# EAGLE design LED_STRING_MANAGER_REV 1 (EAGLE 9.6.2)
DOC_NAME: LED STRING MANAGER; DOC_NUMBER: N/A; DOC_REVISION: 1; INITIALS_DRAWN: KJD

## Sheet 1 of 2
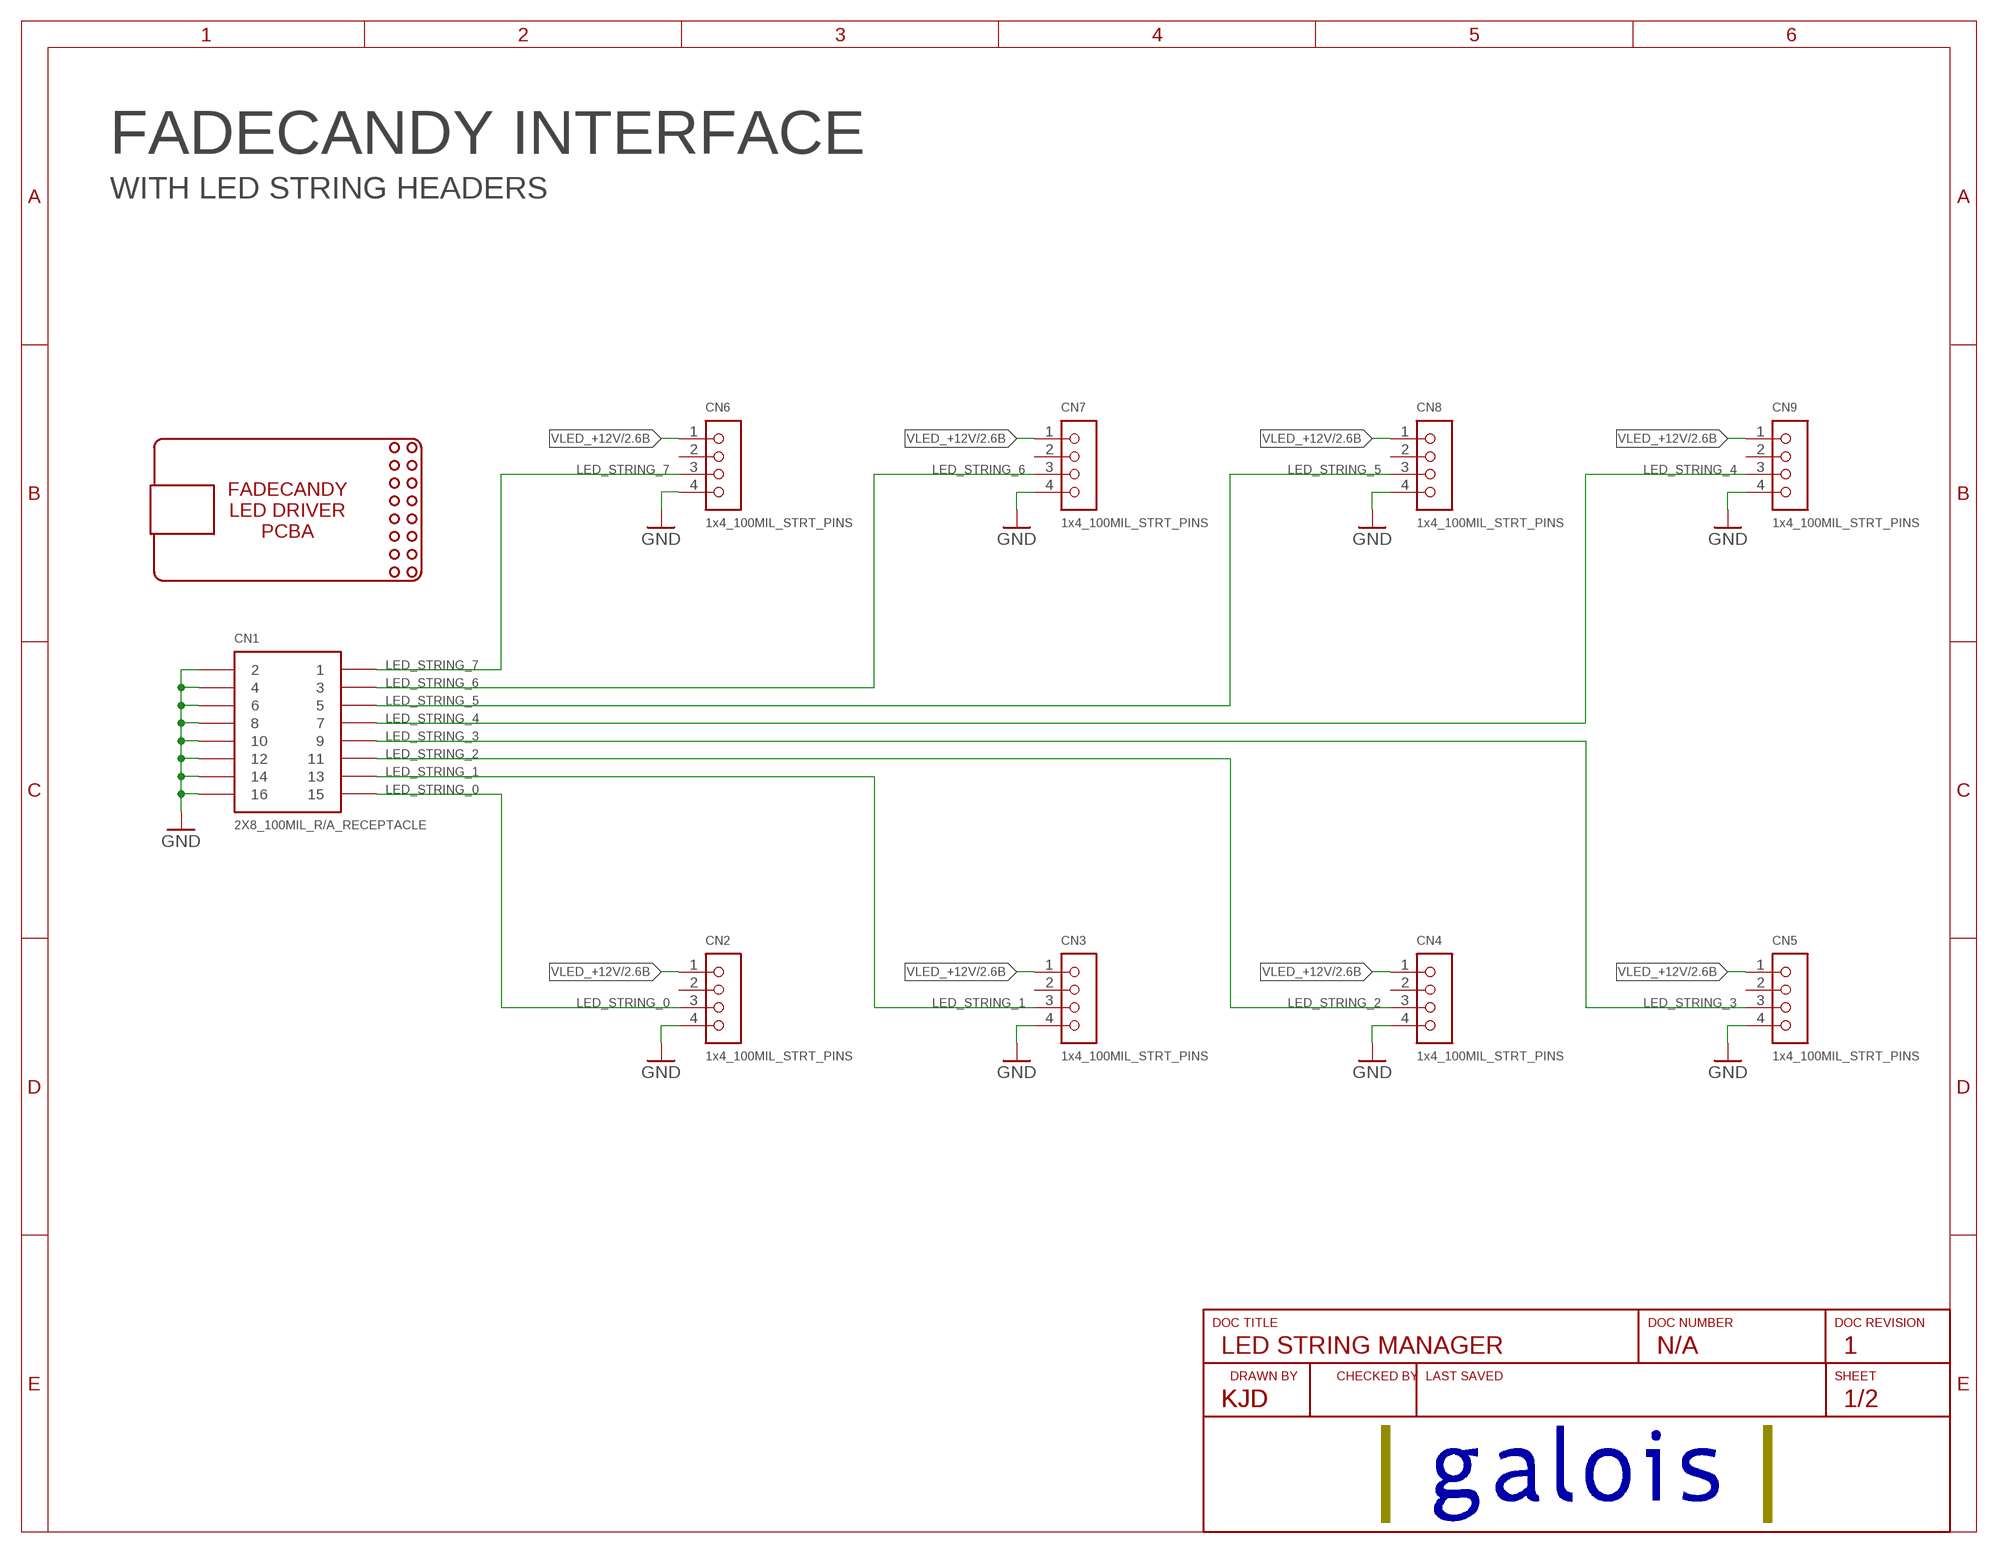
[diagram p0: schematic, sheet 1]

### Parts
CN1  2X8_100MIL_R/A_RECEPTACLE  2X8_RIGHT_ANGLE  [2X8_100MIL_R/A]
CN2  1x4_100MIL_STRT_PINS  MOLEX_CGRID_III_0901361204  [1X4_0901361204]
CN3  1x4_100MIL_STRT_PINS  MOLEX_CGRID_III_0901361204  [1X4_0901361204]
CN4  1x4_100MIL_STRT_PINS  MOLEX_CGRID_III_0901361204  [1X4_0901361204]
CN5  1x4_100MIL_STRT_PINS  MOLEX_CGRID_III_0901361204  [1X4_0901361204]
CN6  1x4_100MIL_STRT_PINS  MOLEX_CGRID_III_0901361204  [1X4_0901361204]
CN7  1x4_100MIL_STRT_PINS  MOLEX_CGRID_III_0901361204  [1X4_0901361204]
CN8  1x4_100MIL_STRT_PINS  MOLEX_CGRID_III_0901361204  [1X4_0901361204]
CN9  1x4_100MIL_STRT_PINS  MOLEX_CGRID_III_0901361204  [1X4_0901361204]
U$3  FADECANDY_PCB_FOOTPRINT  [FADECANDY_PCB_FOOTPRINT]

### Nets
GND: CN1.2 CN1.4 CN1.6 CN1.8 CN1.10 CN1.12 CN1.14 CN1.16 CN2.4 CN3.4 CN4.4 CN5.4 CN6.4 CN7.4 CN8.4 CN9.4 ; also sheet 2
LED_STRING_0: CN1.15 CN2.3
LED_STRING_1: CN1.13 CN3.3
LED_STRING_2: CN1.11 CN4.3
LED_STRING_3: CN1.9 CN5.3
LED_STRING_4: CN1.7 CN9.3
LED_STRING_5: CN1.5 CN8.3
LED_STRING_6: CN1.3 CN7.3
LED_STRING_7: CN1.1 CN6.3
VLED_+12V: CN2.1 CN3.1 CN4.1 CN5.1 CN6.1 CN7.1 CN8.1 CN9.1 ; also sheet 2
Unconnected: CN2.2 CN3.2 CN4.2 CN5.2 CN6.2 CN7.2 CN8.2 CN9.2

### Notes on the sheet
- FADECANDY INTERFACE
- WITH LED STRING HEADERS
- KJD

## Sheet 2 of 2
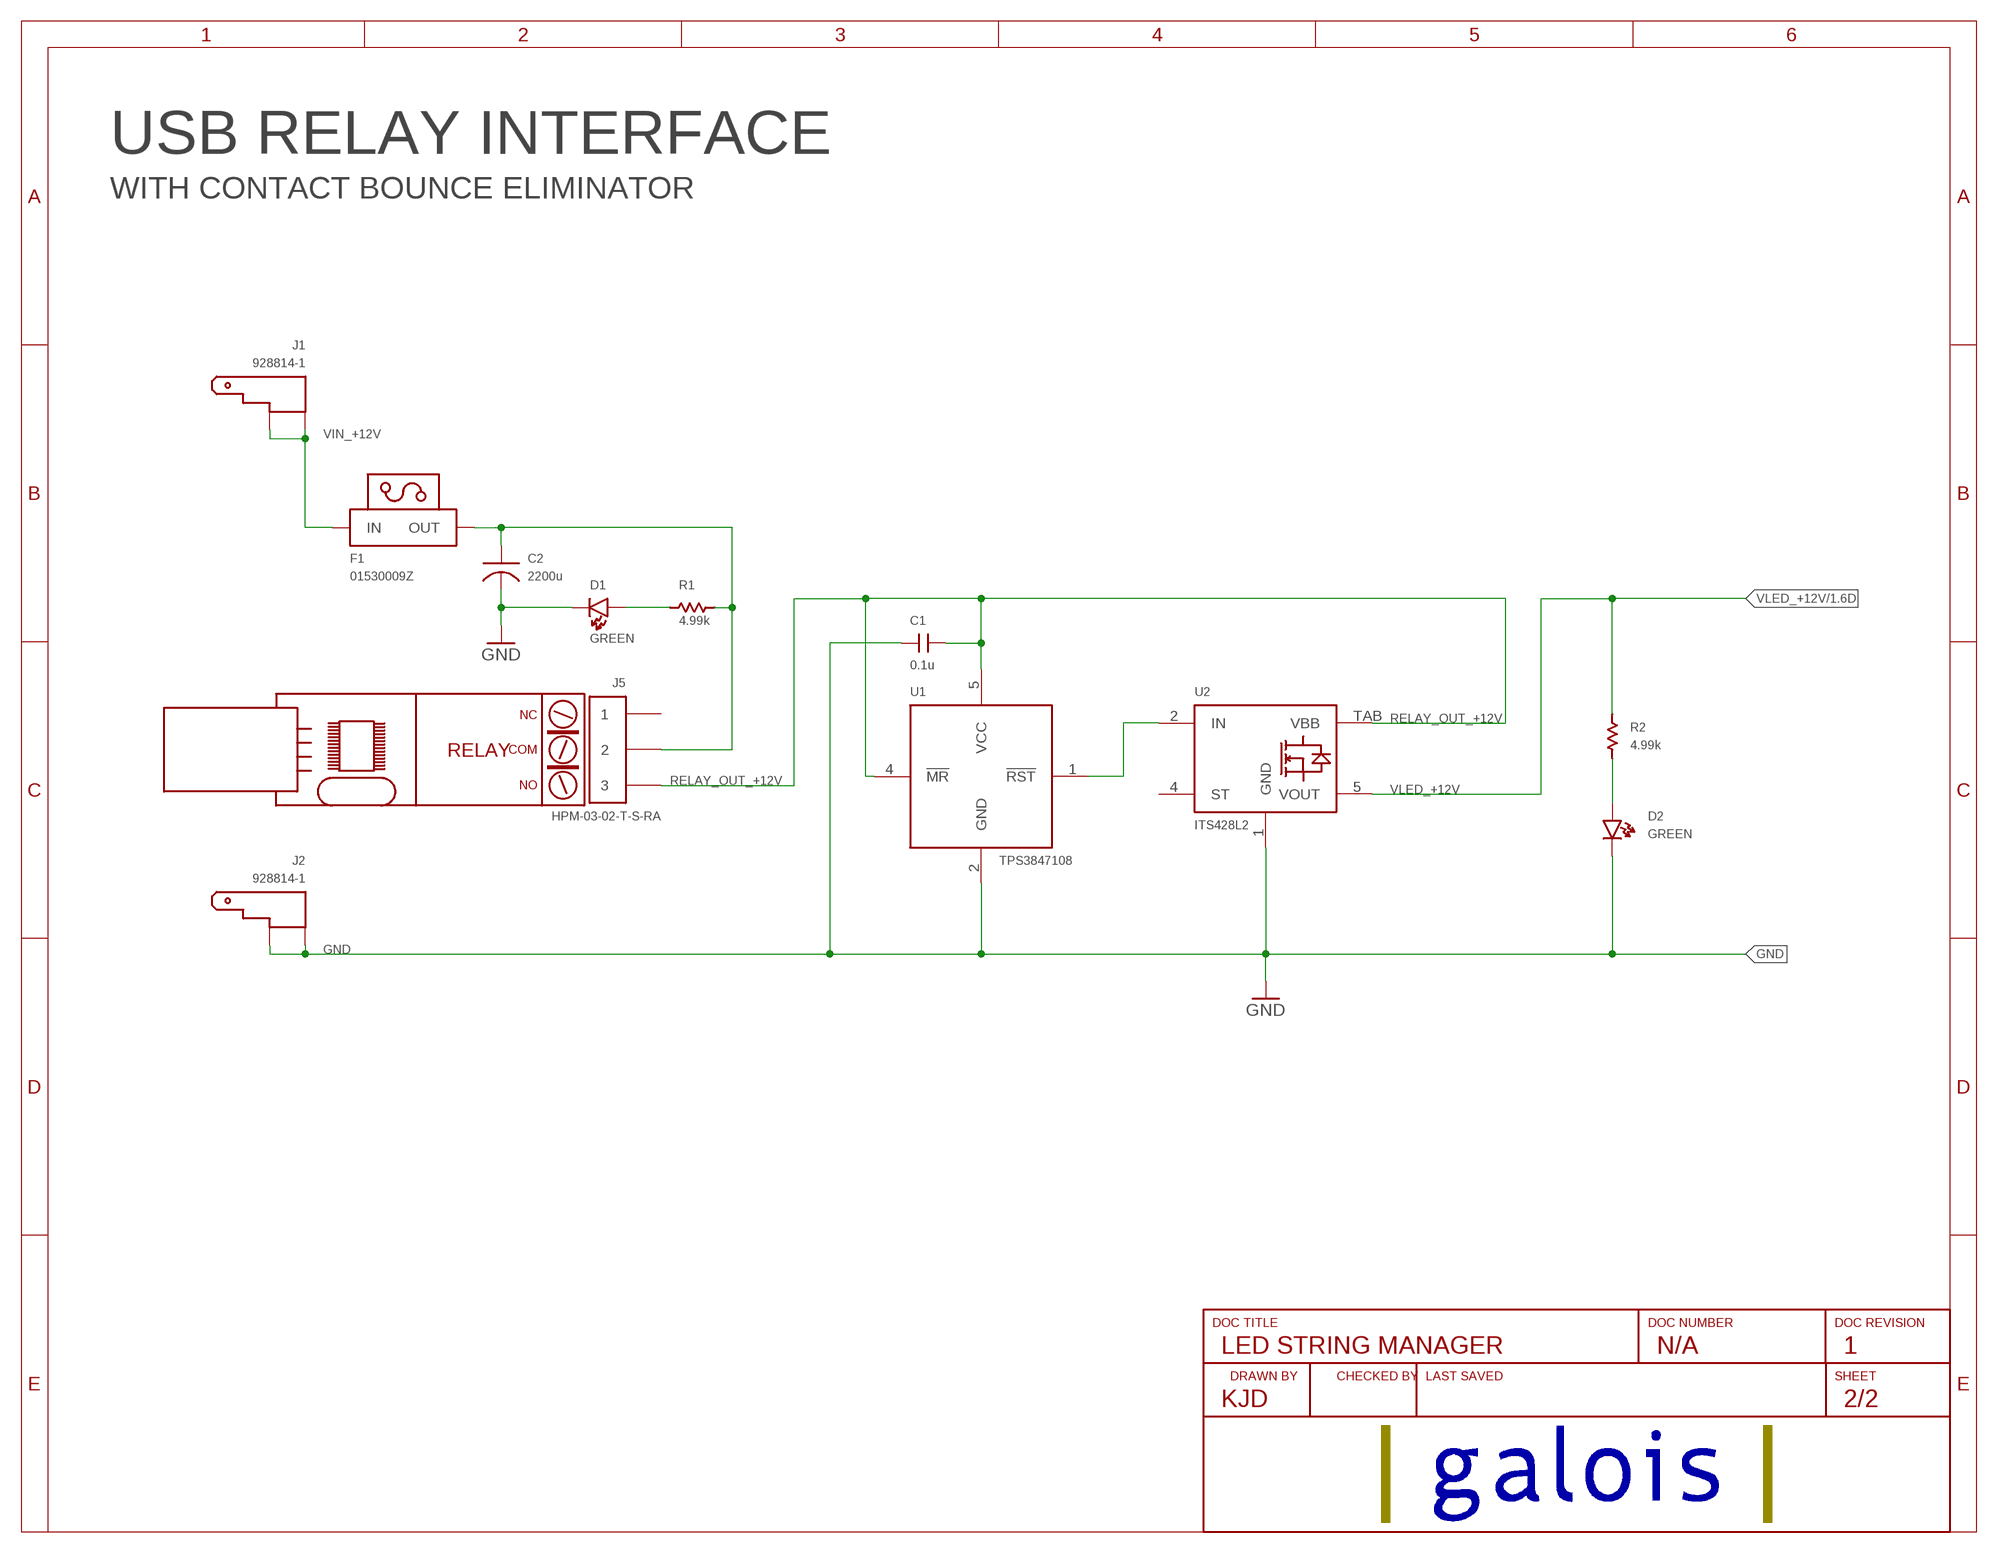
[diagram p1: schematic, sheet 2]

### Parts
C1  0.1u  C_SMDC0603  [EIA0603]
C2  2200u  C_POLARIZED_DIA_12.5MM_LEADS_5MM  [PANASONIC_HD_12.5MM]
D1  GREEN  LED_SMD  [EIA0603_LED]
D2  GREEN  LED_SMD  [EIA0603_LED]
F1  01530009Z  FUSE_HOLDER_AUTOMOTIVE_MINI_BLADE  [LITTELFUSE_MINI_BLADE_HOLDER_01530009]
J1  928814-1  FASTON_PCB_THRU_R/A  [FASTON_MALE_SERIES_250_THRU_R/A]
J2  928814-1  FASTON_PCB_THRU_R/A  [FASTON_MALE_SERIES_250_THRU_R/A]
J5  HPM-03-02-T-S-RA  HPM_1X3_R/A  [HPM_1X3_R/A]
R1  4.99k  R_SMDR0603  [EIA0603]
R2  4.99k  R_SMDR0603  [EIA0603]
U1  TPS3847108  TPS3847  [SOT23-5]
U2  ITS428L2  [PG-TO252-5-11]
U$4  USB_RELAY_PCB_FOOTPRINT  [USB_RELAY_PCB_FOOTPRINT]

### Nets
FUSED_+12V: C2.C+ F1.2(OUT) J5.2 R1.P$2
GND: C1.P$1 C2.C- D1.C D2.C J2.1 J2.2 U1.2(GND) U2.1(GND) ; also sheet 1
N$1: D2.A R2.P$1
N$2: D1.A R1.P$1
N$3: U1.1(!RST) U2.2(IN)
RELAY_OUT_+12V: C1.P$2 J5.3 U1.4(!MR) U1.5(VCC) U2.TAB(VBB)
VIN_+12V: F1.1(IN) J1.1 J1.2
VLED_+12V: R2.P$2 U2.5(VOUT) ; also sheet 1
Unconnected: J5.1 U2.4(ST)

### Notes on the sheet
- USB RELAY INTERFACE
- WITH CONTACT BOUNCE ELIMINATOR

## Library data of the parts
C1 = USER_SMT_CHIP_STANDARD:C_SMD; MPN: CL10B104KB8NNNC; PACKAGE: 0603
C2 = USER_CAPACITORS_ELECTROLYTIC:C_POLARIZED; MPN: EEU-HD1E222
CN1 = USER_CON_PINS:2X8; MPN: PPPC082LJBN-RC
CN2-CN9 = USER_MOLEX_CGRID_III:MOLEX_CGRID_III_0901361204; MPN: 0901361204
D1 D2 = USER_SMT_CHIP_STANDARD:LED_SMD; MPN: LG Q396-PS-35
F1 = USER_CIRCUIT_PROTECTION:FUSE_HOLDER; MPN: 01530009Z
J1 J2 = USER_CON_HIGH_CURRENT:FASTON_PCB_THRU_R/A; MPN: 928814-1
J5 = USER_CON_HIGH_CURRENT:HPM_1X3_R/A; MPN: HPM-03-02-T-S-RA
R1 R2 = USER_SMT_CHIP_STANDARD:R_SMD; MPN: ERJ-3EKF4991V; PACKAGE: 0603
U1 = USER_PMIC:TPS3847; MPN: TPS3847108DBVR
U2 = USER_SMART_SWITCHES:ITS428L2; MPN: ITS428L2ATMA1
U$3 = USER_GALOIS_CYBERPHYS:FADECANDY_PCB_FOOTPRINT
U$4 = USER_GALOIS_CYBERPHYS:USB_RELAY_PCB_FOOTPRINT

## Board
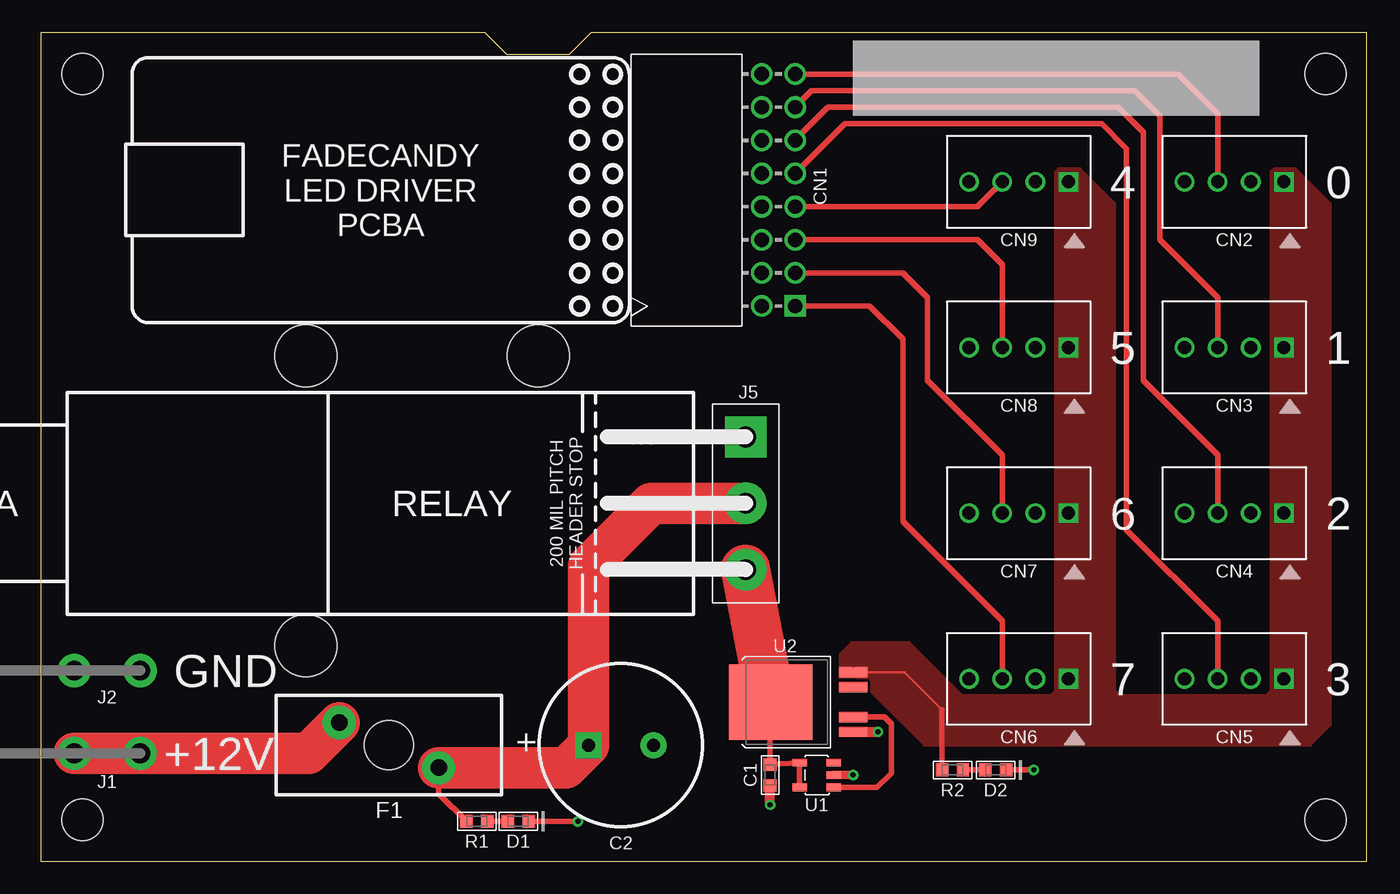
[diagram p2: board, top side]
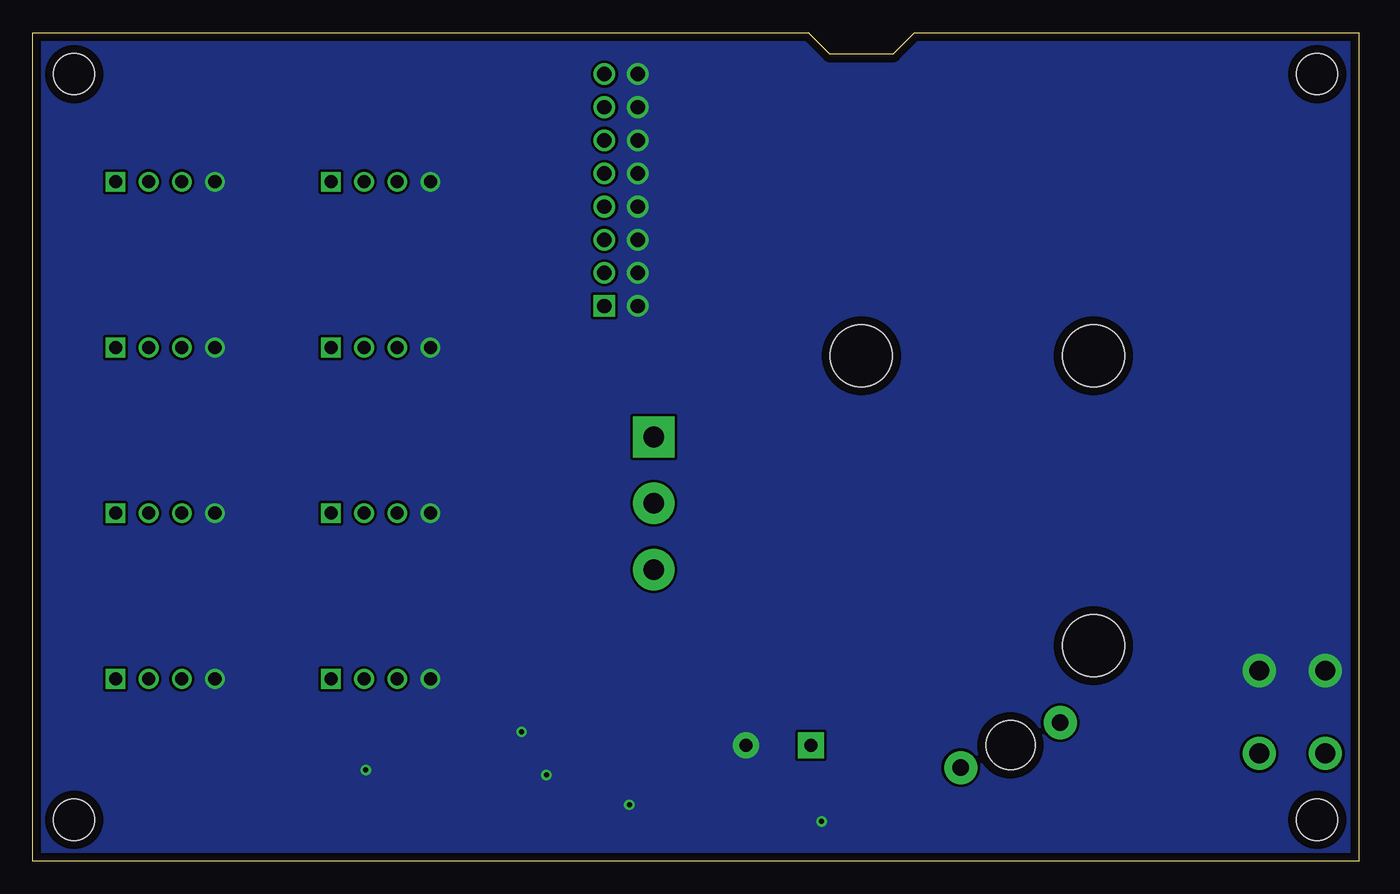
[diagram p3: board, bottom side, seen from below]

Size 101.6 x 63.5 mm. Coordinates in mm from the lower left corner, seen from the top.
Outline: 0,0 101.6,0 101.6,63.5 42.16,63.5 40.51,61.85 35.69,61.85 34.04,63.5 0,63.5 0,0
Copper layers (1*16): Top 0.035mm / dielectric 1.5mm / Bottom 0.035mm
Design rules "default *": minimum track width 6mil, minimum drill 0.35mm, track to track 6mil, track to pad 6mil, pad to pad 6mil, via to via 6mil, smd to smd 6mil, copper to edge 25mil, drill to drill 6mil, minimum pad ring 10mil, minimum via ring 8mil, stop-mask expansion 4mil, vias tented up to drill 0mil, thermal gap 10mil
Holes 4.76 mm at 20.32,16.51 20.32,38.73 38.1,38.73
Holes 3.17 mm at 3.17,60.33 3.17,3.17 98.42,3.17 98.42,60.33

### Footprints (pad centres in the part's own frame; a part is rotated, then mirrored left to right if it is on the bottom)
EIA0603 = smd 0.95 x 1: P$1 -0.8,0; P$2 0.8,0
PANASONIC_HD_12.5MM = drill 1 pad 2 square: C+ -2.5,0 | drill 1 pad 2: C- 2.5,0
2X8_100MIL_R/A = drill 1.1 square: 1 -1.27,8.89 | drill 1.1: 2 1.27,8.89; 3 -1.27,6.35; 4 1.27,6.35; 5 -1.27,3.81; 6 1.27,3.81; 7 -1.27,1.27; 8 1.27,1.27; 9 -1.27,-1.27; 10 1.27,-1.27; 11 -1.27,-3.81; 12 1.27,-3.81; 13 -1.27,-6.35; 14 1.27,-6.35; 15 -1.27,-8.89; 16 1.27,-8.89
1X4_0901361204 = drill 1 square: 1 3.81,0 | drill 1: 2 1.27,0; 3 -1.27,0; 4 -3.81,0
EIA0603_LED = smd 0.95 x 1: A -0.8,0; C 0.8,0
LITTELFUSE_MINI_BLADE_HOLDER_01530009 = drill 1.27 pad 2.54: 1 -1.727,-3.81; 2 1.727,3.81 | hole 3.785: 0,0
FASTON_MALE_SERIES_250_THRU_R/A = drill 1.524 pad 2.54: 1 -2.54,0; 2 2.54,0
HPM_1X3_R/A = drill 1.575 pad 3.175 square: 1 -5.08,0 | drill 1.575 pad 3.175: 2 0,0; 3 5.08,0
SOT23-5 = smd 1.1 x 0.6: 1 -1.3,0.95; 2 -1.3,0; 3 -1.3,-0.95; 4 1.3,-0.95; 5 1.3,0.95
PG-TO252-5-11 = smd 0.8 x 2.2: 1 -2.28,0; 2 -1.14,0; 4 1.14,0; 5 2.28,0 | smd 5.8 x 6.4: TAB 0,6.3

### Placement (x,y rotation side)
C1  55.88,6.6 90 top
C2  44.45,8.89 0 top
CN1  56.52,51.44 180 top
CN2  91.44,52.07 0 top
CN3  91.44,39.37 0 top
CN4  91.44,26.67 0 top
CN5  91.44,13.97 0 top
CN6  74.93,13.97 0 top
CN7  74.93,26.67 0 top
CN8  74.93,39.37 0 top
CN9  74.93,52.07 0 top
D1  36.58,3.05 0 top
D2  73.15,6.99 0 top
F1  26.67,8.89 270 top
J1  5.08,8.26 180 top
J2  5.08,14.61 180 top
J5  54,27.43 270 top
R1  33.4,3.05 180 top
R2  69.85,6.99 180 top
U1  59.44,6.6 180 top
U2  62.23,12.19 90 top
U$3  26.04,51.44 0 top
U$4  26,27.43 0 top

### Tracks (layer width: path | path; a pad name or v marks a point on that pad's centre or on a via)
FUSED_+12V
  Top 0.406: R1.P$2 30.48,5.17 F1.2
  Top 3.175: F1.2 40.22,7.16 C2.C+ 41.95,22.65 46.74,27.43 49.15,27.43 J5.2
GND  (via drill 0.38)
  Top 0.406: D1.C v41.15,3.05 | D2.C v76.07,6.99
  Top 0.635: v62.23,6.6 U1.2
  Top 0.762: v55.88,4.32 C1.P$1 | U2.1 v64.14,9.91
  pour Bottom (isolate 0.203, no thermals): 101.6,0 0,0 0,63.5 101.6,63.5
LED_STRING_0
  Top 0.406: CN1.15 87.12,60.33 90.17,57.28 CN2.3
LED_STRING_1
  Top 0.406: CN1.13 59.05,59.05 83.82,59.05 85.72,57.15 85.72,47.62 90.17,43.18 CN3.3
LED_STRING_2
  Top 0.406: CN1.11 60.33,57.78 82.55,57.78 84.45,55.88 84.45,36.83 90.17,31.11 CN4.3
LED_STRING_3
  Top 0.406: CN1.9 61.59,56.52 81.28,56.52 83.19,54.61 83.19,25.4 90.17,18.41 CN5.3
LED_STRING_4
  Top 0.406: CN1.7 71.75,50.16 CN9.3
LED_STRING_5
  Top 0.406: CN1.5 71.75,47.62 73.66,45.72 CN8.3
LED_STRING_6
  Top 0.406: CN1.3 66.04,45.09 67.94,43.18 67.94,36.83 73.66,31.11 CN7.3
LED_STRING_7
  Top 0.406: CN1.1 63.5,42.55 66.04,40.01 66.04,26.04 73.66,18.41 CN6.3
N$1
  Top 0.406: R2.P$1 D2.A
N$2
  Top 0.406: R1.P$1 D1.A
N$3
  Top 0.406: U1.1 64.07,5.65 65.15,6.73 65.15,10.54 64.64,11.05 U2.2
RELAY_OUT_+12V
  Top 0.406: U1.5 U1.4 C1.P$2 55.88,12.14 U2.TAB
  Top 3.81: U2.TAB J5.3
VIN_+12V
  Top 3.175: J1.2 J1.1 20.5,8.26 F1.1
VLED_+12V
  Top 0.203: U2.5 66.17,14.47 69.05,11.6
  Top 0.406: R2.P$2 69.05,11.6
  pour Top (isolate 0.203, no thermals): 62.48,14.1 61.21,14.1 61.21,15.88 62.1,16.76 66.55,16.76 70.61,12.7 77.34,12.7 77.72,13.08 77.72,52.83 77.98,53.09 79.63,53.09 82.3,50.42 82.3,13.08 82.68,12.7 93.85,12.7 94.23,13.08 94.23,52.83 94.49,53.09 96.14,53.09 98.81,50.42 98.81,10.41 97.28,8.89 67.69,8.89

### Text on the board
tPlace: 4 | 0 | 5 | 1 | 6 | 2 | GND | 7 | 3 | +12V